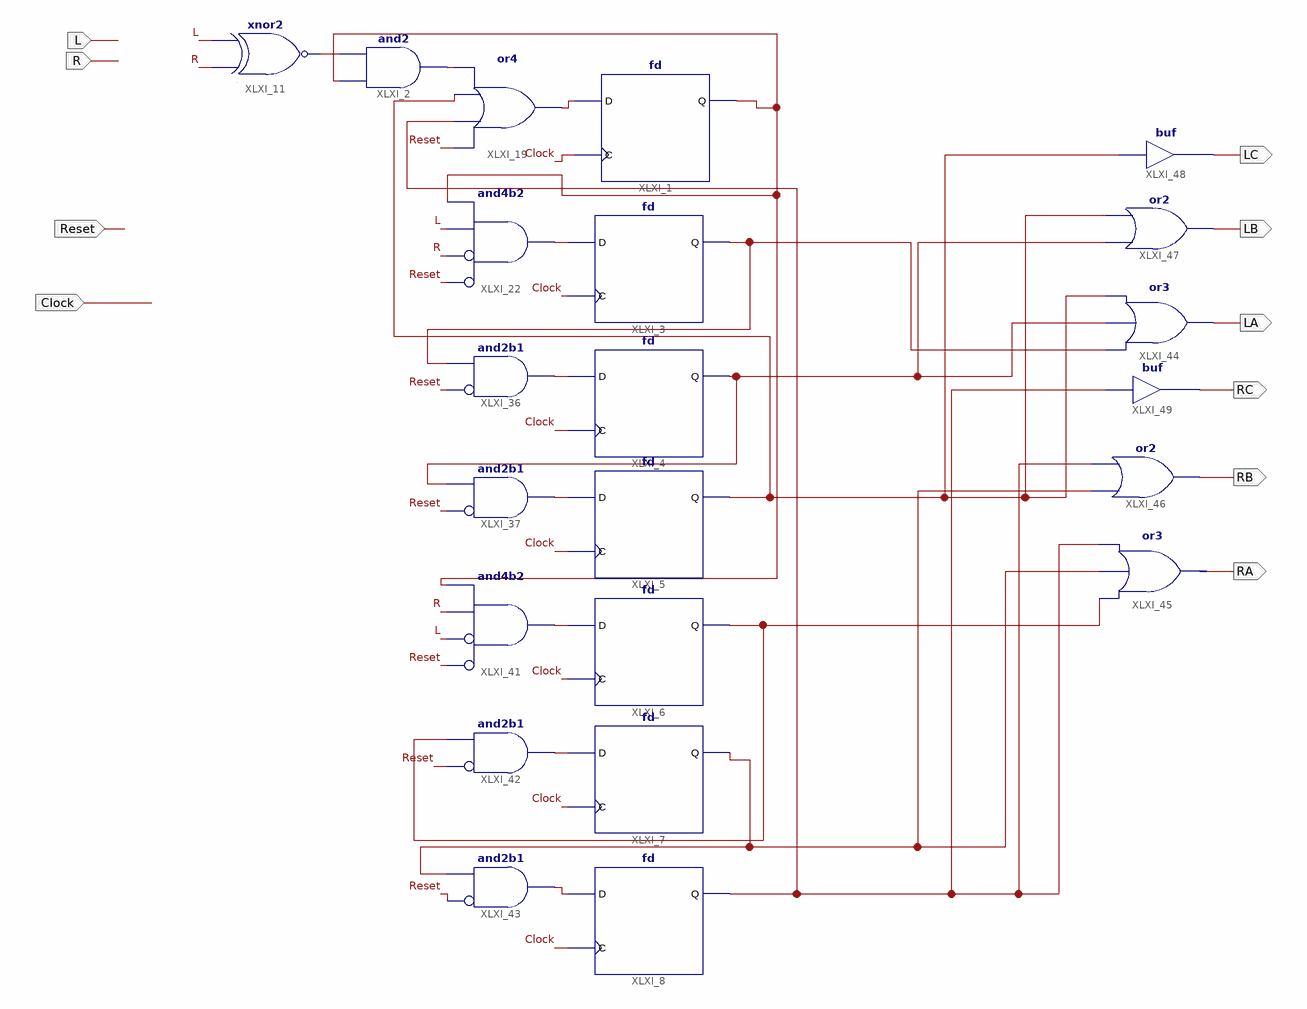
[diagram p0: schematic sheet 1]
// Xilinx ISE schematic state_machine_dwe.sch (spartan3) as structural Verilog: 22 symbols, 10 ports
module state_machine_dwe (
  input  L,
  input  Reset,
  input  R,
  input  Clock,
  output LA,
  output RC,
  output LC,
  output LB,
  output RA,
  output RB
);

  wire XLXN_2, XLXN_20, XLXN_21, XLXN_58, XLXN_59, XLXN_64, XLXN_65, XLXN_67, XLXN_68, XLXN_71, XLXN_76,
       XLXN_77, XLXN_78, XLXN_79, XLXN_99, XLXN_107;

  fd XLXI_1 (.C(Clock), .D(XLXN_58), .Q(XLXN_2));
  fd XLXI_3 (.C(Clock), .D(XLXN_59), .Q(XLXN_65));
  fd XLXI_4 (.C(Clock), .D(XLXN_64), .Q(XLXN_99));
  fd XLXI_5 (.C(Clock), .D(XLXN_67), .Q(XLXN_68));
  fd XLXI_6 (.C(Clock), .D(XLXN_71), .Q(XLXN_78));
  fd XLXI_7 (.C(Clock), .D(XLXN_76), .Q(XLXN_79));
  fd XLXI_8 (.C(Clock), .D(XLXN_77), .Q(XLXN_107));
  xnor XLXI_11 (XLXN_20, R, L);
  and XLXI_2 (XLXN_21, XLXN_2, XLXN_20);
  or XLXI_19 (XLXN_58, Reset, XLXN_107, XLXN_68, XLXN_21);
  and XLXI_22 (XLXN_59, ~Reset, ~R, L, XLXN_2);  // and4b2
  and XLXI_36 (XLXN_64, ~Reset, XLXN_65);  // and2b1
  and XLXI_37 (XLXN_67, ~Reset, XLXN_99);  // and2b1
  and XLXI_41 (XLXN_71, ~Reset, ~L, R, XLXN_2);  // and4b2
  and XLXI_42 (XLXN_76, ~Reset, XLXN_78);  // and2b1
  and XLXI_43 (XLXN_77, ~Reset, XLXN_79);  // and2b1
  or XLXI_44 (LA, XLXN_65, XLXN_99, XLXN_68);
  or XLXI_45 (RA, XLXN_78, XLXN_79, XLXN_107);
  or XLXI_46 (RB, XLXN_79, XLXN_107);
  or XLXI_47 (LB, XLXN_99, XLXN_68);
  buf XLXI_48 (LC, XLXN_68);
  buf XLXI_49 (RC, XLXN_107);
endmodule
